# Altium project FastCharge.PrjPcb
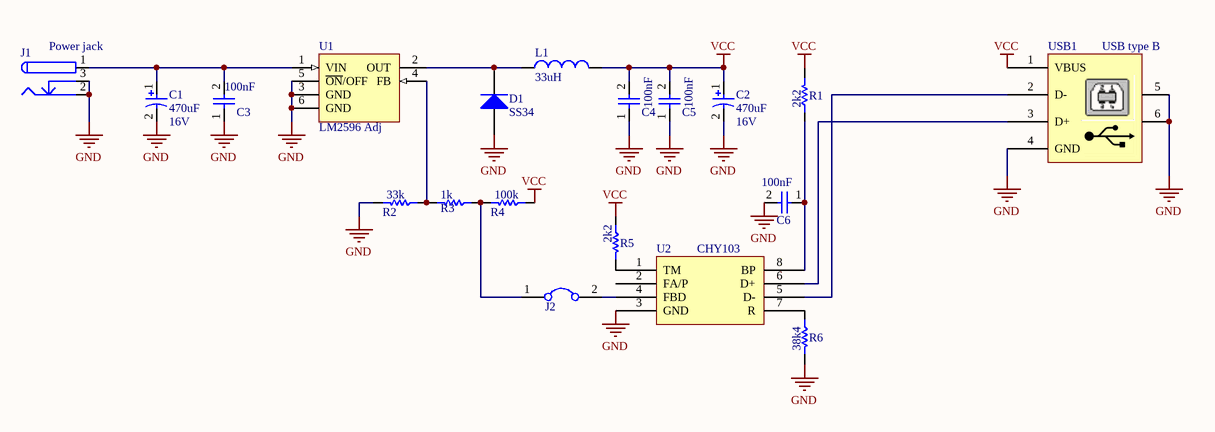
[diagram p0: FastCharge.SchDoc]
1 sheet, 19 parts. Net scope: global (net labels, ports and power ports of the same name join across sheets).
Board file: FASTCHARGE.PcbDoc

## Sheet FastCharge.SchDoc
size A

### Parts
C1  470uF  [Cap 3.5mm]
C2  470uF  [Cap 3.5mm]
C3  100nF  [SMD 0805]
C4  100nF  [SMD 0805]
C5  100nF  [SMD 0805]
C6  100nF  [SMD 0805]
D1  SS34  [DIODE DO-214AC SMD]
J1  Power jack  [Power Jack]
J2  JUMPER  [Jumper Header 2X1]  (value not drawn)
L1  33uH  [Inductor 5.8mm]
R1  2k2  [0805_1/8W]
R2  33k  [0805_1/8W]
R3  1k  [0805_1/8W]
R4  100k  [0805_1/8W]
R5  2k2  [0805_1/8W]
R6  38k4  [0805_1/8W]
U1  LM2596 Adj  [TO-263 5 LEAD]
U2  CHY103  [SOIC 8-Lead  (3.8mm)]
USB1  USB Connector-B Type  [USB2.5-2H4C]  (value not drawn)

### Nets
GND: C1.2 C2.2 C3.1 C4.1 C5.1 C6.2 D1.1(A) J1.2 J1.3 R2.2 R6.2 U1.3(GND) U1.5(~{ON}/OFF) U1.6(GND) U2.3(GND) USB1.4(GND) USB1.5 USB1.6
VCC: C2.1 C4.2 C5.2 L1.2 R1.2 R4.1 R5.1 USB1.1(VBUS)
NetC1_1: C1.1 C3.2 J1.1 U1.1(VIN)
NetC6_1: C6.1 R1.1 U2.8(BP)
NetD1_2: D1.2(K) L1.1 U1.2(OUT)
NetJ2_1: J2.1 R3.1 R4.2
NetJ2_2: J2.2 U2.4(FBD)
NetR2_1: R2.1 R3.2 U1.4(FB)
NetR5_2: R5.2 U2.1(TM)
NetR6_1: R6.1 U2.7(R)
NetU2_5: U2.5(D-) USB1.2(D-)
NetU2_6: U2.6(D+) USB1.3(D+)

Not connected (* = marked no-connect by the designer): U2 2(FA/P)

### Notes on the sheet
- (in symbol CAP) 16V
- (in symbol USB Connector-B Type) USB type B

### Library data of the parts
C1 C2 = CAP
C3-C6 = CAP NON
D1 = Diode
L1 = Inductor
R1-R6 = RESISTOR
U1 = LM2576 SMD